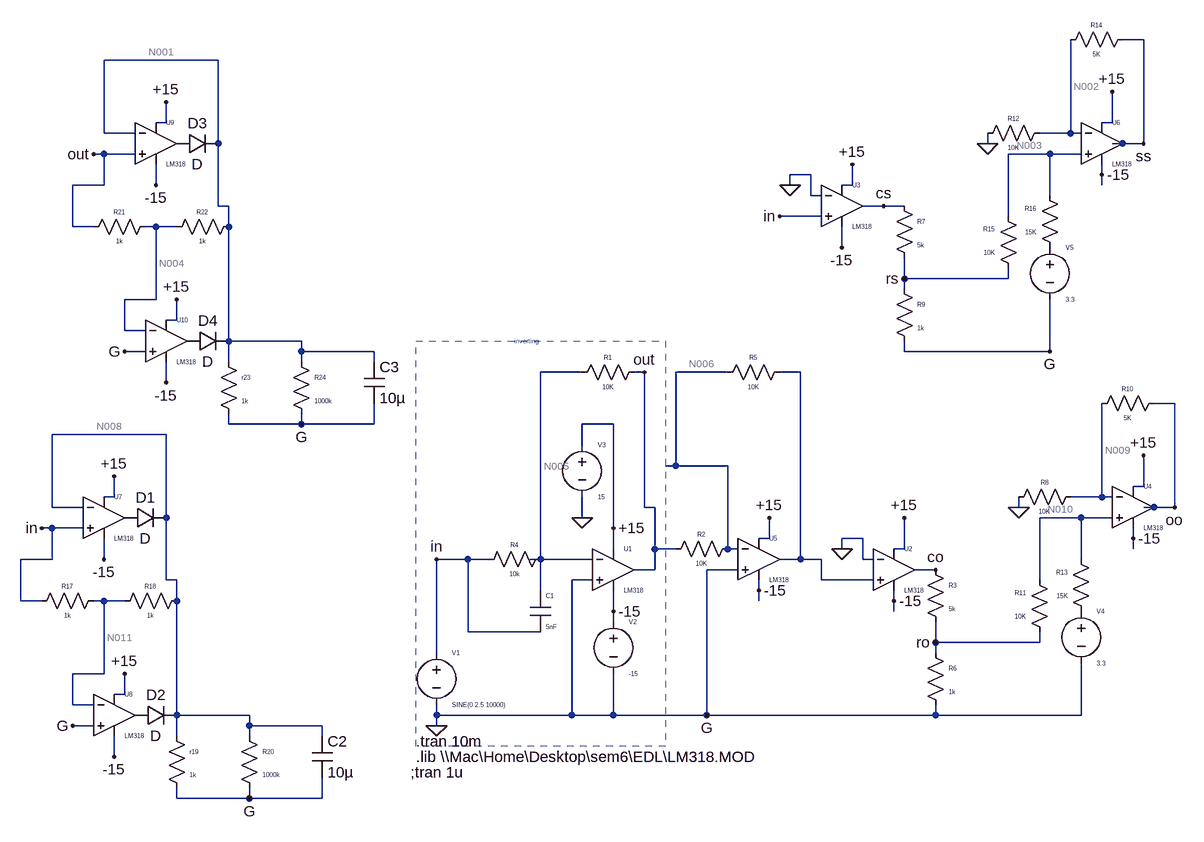
[diagram p0: schematic LM118.asc]
LM118.asc, the LTspice schematic file:
Version 4
SHEET 1 2252 1484
WIRE 1424 -832 1392 -832
WIRE 0 -800 -176 -800
WIRE -80 -704 -80 -736
WIRE -80 -704 -96 -704
WIRE 1376 -704 1376 -752
WIRE 1376 -704 1360 -704
WIRE -176 -688 -176 -800
WIRE -128 -688 -176 -688
WIRE 1312 -688 1312 -832
WIRE 1312 -688 1264 -688
WIRE 1328 -688 1312 -688
WIRE 0 -672 0 -800
WIRE 1184 -672 1184 -688
WIRE 1392 -672 1376 -672
WIRE 1424 -672 1424 -832
WIRE 1424 -672 1392 -672
WIRE -176 -656 -192 -656
WIRE -128 -656 -176 -656
WIRE 1280 -656 1216 -656
WIRE 1328 -656 1280 -656
WIRE 912 -624 880 -624
WIRE 1360 -624 1360 -640
WIRE -176 -608 -176 -656
WIRE -176 -608 -224 -608
WIRE -96 -608 -96 -640
WIRE 880 -608 880 -624
WIRE 976 -608 976 -640
WIRE 976 -608 960 -608
WIRE 1360 -608 1360 -624
WIRE 912 -592 912 -624
WIRE 928 -592 912 -592
WIRE 1280 -592 1280 -656
WIRE 0 -576 0 -672
WIRE 16 -576 0 -576
WIRE 1024 -576 992 -576
WIRE 1056 -576 1024 -576
WIRE 928 -560 864 -560
WIRE 1216 -560 1216 -656
WIRE -224 -544 -224 -608
WIRE -192 -544 -224 -544
WIRE -96 -544 -112 -544
WIRE -64 -544 -96 -544
WIRE 16 -544 16 -576
WIRE 960 -512 960 -544
WIRE 1056 -464 1056 -496
WIRE 1216 -464 1216 -480
WIRE 1216 -464 1056 -464
WIRE 1056 -448 1056 -464
WIRE -96 -432 -96 -544
WIRE -96 -432 -144 -432
WIRE -64 -400 -64 -432
WIRE -64 -400 -80 -400
WIRE -144 -384 -144 -432
WIRE -112 -384 -144 -384
WIRE 16 -368 16 -544
WIRE 128 -368 16 -368
WIRE -112 -352 -144 -352
WIRE 128 -352 128 -368
WIRE 240 -352 128 -352
WIRE 1056 -352 1056 -368
WIRE 1280 -352 1280 -432
WIRE 1280 -352 1056 -352
WIRE 16 -336 16 -368
WIRE 128 -336 128 -352
WIRE 240 -336 240 -352
WIRE 560 -320 496 -320
WIRE 656 -320 640 -320
WIRE 784 -320 704 -320
WIRE 896 -320 864 -320
WIRE -80 -304 -80 -336
WIRE 1472 -272 1440 -272
WIRE 16 -240 16 -256
WIRE 128 -240 128 -256
WIRE 128 -240 16 -240
WIRE 240 -240 240 -272
WIRE 240 -240 128 -240
WIRE 608 -240 560 -240
WIRE -80 -224 -256 -224
WIRE 560 -208 560 -240
WIRE 704 -176 704 -320
WIRE 704 -176 688 -176
WIRE 784 -176 704 -176
WIRE 1424 -144 1424 -192
WIRE 1424 -144 1408 -144
WIRE -160 -128 -160 -160
WIRE -160 -128 -176 -128
WIRE 1360 -128 1360 -272
WIRE 1360 -128 1312 -128
WIRE 1376 -128 1360 -128
WIRE -256 -112 -256 -224
WIRE -208 -112 -256 -112
WIRE 656 -112 656 -320
WIRE 672 -112 656 -112
WIRE 1232 -112 1232 -128
WIRE 1440 -112 1424 -112
WIRE 1472 -112 1472 -272
WIRE 1472 -112 1440 -112
WIRE -80 -96 -80 -224
WIRE 560 -96 560 -128
WIRE 1328 -96 1264 -96
WIRE 1376 -96 1328 -96
WIRE -256 -80 -272 -80
WIRE -208 -80 -256 -80
WIRE 608 -80 608 -240
WIRE 848 -64 848 -96
WIRE 848 -64 832 -64
WIRE 992 -64 960 -64
WIRE 1408 -64 1408 -80
WIRE 608 -48 608 -80
WIRE 672 -48 672 -112
WIRE 704 -48 672 -48
WIRE 784 -48 784 -176
WIRE 800 -48 784 -48
WIRE 960 -48 960 -64
WIRE 1056 -48 1056 -96
WIRE 1056 -48 1040 -48
WIRE 1408 -48 1408 -64
WIRE -256 -32 -256 -80
WIRE -256 -32 -304 -32
WIRE -176 -32 -176 -64
WIRE 384 -32 336 -32
WIRE 416 -32 384 -32
WIRE 496 -32 496 -320
WIRE 496 -32 480 -32
WIRE 576 -32 496 -32
WIRE 896 -32 896 -320
WIRE 896 -32 864 -32
WIRE 928 -32 896 -32
WIRE 992 -32 992 -64
WIRE 1008 -32 992 -32
WIRE 1328 -32 1328 -96
WIRE 672 -16 672 -48
WIRE 672 -16 640 -16
WIRE 800 -16 752 -16
WIRE 1104 -16 1072 -16
WIRE -80 0 -80 -96
WIRE -64 0 -80 0
WIRE 576 0 544 0
WIRE 928 0 928 -32
WIRE 1008 0 928 0
WIRE 1264 0 1264 -96
WIRE 496 16 496 -32
WIRE 832 16 832 0
WIRE -304 32 -304 -32
WIRE -272 32 -304 32
WIRE -176 32 -192 32
WIRE -144 32 -176 32
WIRE -64 32 -64 0
WIRE 832 32 832 16
WIRE 1040 32 1040 16
WIRE 608 48 608 16
WIRE 1040 48 1040 32
WIRE 608 64 608 48
WIRE 384 80 384 -32
WIRE 496 80 384 80
WIRE 1104 96 1104 64
WIRE 1264 96 1264 80
WIRE 1264 96 1104 96
WIRE 336 112 336 -32
WIRE 1104 112 1104 96
WIRE -176 144 -176 32
WIRE -176 144 -224 144
WIRE -144 176 -144 144
WIRE -144 176 -160 176
WIRE -224 192 -224 144
WIRE -192 192 -224 192
WIRE -64 208 -64 32
WIRE 48 208 -64 208
WIRE 336 208 336 192
WIRE 544 208 544 0
WIRE 544 208 336 208
WIRE 608 208 608 144
WIRE 608 208 544 208
WIRE 752 208 752 -16
WIRE 752 208 608 208
WIRE 1104 208 1104 192
WIRE 1104 208 752 208
WIRE 1328 208 1328 128
WIRE 1328 208 1104 208
WIRE -192 224 -224 224
WIRE 48 224 48 208
WIRE 160 224 48 224
WIRE 336 224 336 208
WIRE -64 240 -64 208
WIRE 48 240 48 224
WIRE 160 240 160 224
WIRE -160 272 -160 240
WIRE -64 336 -64 320
WIRE 48 336 48 320
WIRE 48 336 -64 336
WIRE 160 336 160 304
WIRE 160 336 48 336
FLAG 336 224 0
FLAG 656 -320 out
FLAG 336 -32 in
FLAG 560 -96 0
FLAG 880 -608 0
FLAG 1024 -576 cs
FLAG 864 -560 in
FLAG 960 -48 0
FLAG 1104 -16 co
FLAG 608 -80 +15
FLAG 848 -96 +15
FLAG 1056 -96 +15
FLAG 976 -640 +15
FLAG 608 48 -15
FLAG 832 16 -15
FLAG 1040 32 -15
FLAG 960 -512 -15
FLAG 1104 96 ro
FLAG 1232 -112 0
FLAG 1424 -192 +15
FLAG 1408 -64 -15
FLAG 1472 -112 oo
FLAG 1056 -464 rs
FLAG 1184 -672 0
FLAG 1376 -752 +15
FLAG 1360 -624 -15
FLAG 1424 -672 ss
FLAG 752 208 G
FLAG 1280 -352 G
FLAG -272 -80 in
FLAG -160 -160 +15
FLAG -176 -32 -15
FLAG -144 144 +15
FLAG -160 272 -15
FLAG -224 224 G
FLAG 48 336 G
FLAG -192 -656 out
FLAG -80 -736 +15
FLAG -96 -608 -15
FLAG -64 -432 +15
FLAG -80 -304 -15
FLAG -144 -352 G
FLAG 128 -240 G
SYMBOL voltage 336 96 R0
WINDOW 0 24 16 Left 0
WINDOW 3 24 96 Left 0
WINDOW 123 0 0 Left 0
WINDOW 39 0 0 Left 0
SYMATTR InstName V1
SYMATTR Value SINE(0 2.5 10000)
SYMBOL res 512 -48 R90
WINDOW 0 0 56 VBottom 0
WINDOW 3 32 56 VTop 0
SYMATTR InstName R4
SYMATTR Value 10k
SYMBOL res 656 -336 R90
WINDOW 0 0 56 VBottom 0
WINDOW 3 32 56 VTop 0
SYMATTR InstName R1
SYMATTR Value 10K
SYMBOL voltage 608 48 R0
WINDOW 0 24 16 Left 0
WINDOW 3 24 96 Left 0
WINDOW 123 0 0 Left 0
WINDOW 39 0 0 Left 0
SYMATTR InstName V2
SYMATTR Value -15
SYMBOL voltage 560 -224 R0
WINDOW 0 24 16 Left 0
WINDOW 3 24 96 Left 0
WINDOW 123 0 0 Left 0
WINDOW 39 0 0 Left 0
SYMATTR InstName V3
SYMATTR Value 15
SYMBOL cap 480 16 R0
WINDOW 0 24 8 Left 0
WINDOW 3 24 56 Left 0
SYMATTR InstName C1
SYMATTR Value 5nF
SYMBOL Opamps\\opamp2 608 -80 R0
WINDOW 0 16 32 Left 0
WINDOW 3 16 96 Left 0
SYMATTR InstName U1
SYMATTR Value LM318
SYMBOL Opamps\\opamp2 1040 -80 R0
WINDOW 0 16 32 Left 0
WINDOW 3 16 96 Left 0
SYMATTR InstName U2
SYMATTR Value LM318
SYMBOL Opamps\\opamp2 960 -640 R0
WINDOW 0 16 32 Left 0
WINDOW 3 16 96 Left 0
SYMATTR InstName U3
SYMATTR Value LM318
SYMBOL Opamps\\opamp2 832 -96 R0
WINDOW 0 16 32 Left 0
WINDOW 3 16 96 Left 0
SYMATTR InstName U5
SYMATTR Value LM318
SYMBOL res 800 -64 R90
WINDOW 0 0 56 VBottom 0
WINDOW 3 32 56 VTop 0
SYMATTR InstName R2
SYMATTR Value 10K
SYMBOL res 880 -336 R90
WINDOW 0 0 56 VBottom 0
WINDOW 3 32 56 VTop 0
SYMATTR InstName R5
SYMATTR Value 10K
SYMBOL res 1088 -32 R0
WINDOW 0 36 40 Left 0
WINDOW 3 36 76 Left 0
SYMATTR InstName R3
SYMATTR Value 5k
SYMBOL res 1088 96 R0
WINDOW 0 36 40 Left 0
WINDOW 3 36 76 Left 0
SYMATTR InstName R6
SYMATTR Value 1k
SYMBOL res 1328 -144 R90
WINDOW 0 0 56 VBottom 0
WINDOW 3 32 56 VTop 0
SYMATTR InstName R8
SYMATTR Value 10K
SYMBOL res 1456 -288 R90
WINDOW 0 0 56 VBottom 0
WINDOW 3 32 56 VTop 0
SYMATTR InstName R10
SYMATTR Value 5K
SYMBOL Opamps\\opamp2 1408 -176 R0
WINDOW 0 16 32 Left 0
WINDOW 3 16 96 Left 0
SYMATTR InstName U4
SYMATTR Value LM318
SYMBOL res 1280 96 R180
WINDOW 0 36 76 Left 0
WINDOW 3 36 40 Left 0
SYMATTR InstName R11
SYMATTR Value 10K
SYMBOL voltage 1328 32 R0
WINDOW 0 24 16 Left 0
WINDOW 3 24 96 Left 0
WINDOW 123 0 0 Left 0
WINDOW 39 0 0 Left 0
SYMATTR InstName V4
SYMATTR Value 3.3
SYMBOL res 1344 64 R180
WINDOW 0 36 76 Left 0
WINDOW 3 36 40 Left 0
SYMATTR InstName R13
SYMATTR Value 15K
SYMBOL res 1040 -592 R0
WINDOW 0 36 40 Left 0
WINDOW 3 36 76 Left 0
SYMATTR InstName R7
SYMATTR Value 5k
SYMBOL res 1040 -464 R0
WINDOW 0 36 40 Left 0
WINDOW 3 36 76 Left 0
SYMATTR InstName R9
SYMATTR Value 1k
SYMBOL res 1280 -704 R90
WINDOW 0 0 56 VBottom 0
WINDOW 3 32 56 VTop 0
SYMATTR InstName R12
SYMATTR Value 10K
SYMBOL res 1408 -848 R90
WINDOW 0 0 56 VBottom 0
WINDOW 3 32 56 VTop 0
SYMATTR InstName R14
SYMATTR Value 5K
SYMBOL Opamps\\opamp2 1360 -736 R0
WINDOW 0 16 32 Left 0
WINDOW 3 16 96 Left 0
SYMATTR InstName U6
SYMATTR Value LM318
SYMBOL res 1232 -464 R180
WINDOW 0 36 76 Left 0
WINDOW 3 36 40 Left 0
SYMATTR InstName R15
SYMATTR Value 10K
SYMBOL voltage 1280 -528 R0
WINDOW 0 24 16 Left 0
WINDOW 3 24 96 Left 0
WINDOW 123 0 0 Left 0
WINDOW 39 0 0 Left 0
SYMATTR InstName V5
SYMATTR Value 3.3
SYMBOL res 1296 -496 R180
WINDOW 0 36 76 Left 0
WINDOW 3 36 40 Left 0
SYMATTR InstName R16
SYMATTR Value 15K
SYMBOL Opamps\\opamp2 -176 -160 R0
WINDOW 0 16 32 Left 0
WINDOW 3 16 96 Left 0
SYMATTR InstName U7
SYMATTR Value LM318
SYMBOL diode -144 -80 R270
WINDOW 0 32 32 VTop 2
WINDOW 3 0 32 VBottom 2
SYMATTR InstName D1
SYMBOL res -176 16 R90
WINDOW 0 0 56 VBottom 0
WINDOW 3 32 56 VTop 0
SYMATTR InstName R17
SYMATTR Value 1k
SYMBOL res -48 16 R90
WINDOW 0 0 56 VBottom 0
WINDOW 3 32 56 VTop 0
SYMATTR InstName R18
SYMATTR Value 1k
SYMBOL Opamps\\opamp2 -160 144 R0
WINDOW 0 16 32 Left 0
WINDOW 3 16 96 Left 0
SYMATTR InstName U8
SYMATTR Value LM318
SYMBOL diode -128 224 R270
WINDOW 0 32 32 VTop 2
WINDOW 3 0 32 VBottom 2
SYMATTR InstName D2
SYMBOL res -80 224 R0
WINDOW 0 36 40 Left 0
WINDOW 3 36 76 Left 0
SYMATTR InstName r19
SYMATTR Value 1k
SYMBOL res 32 224 R0
WINDOW 0 36 40 Left 0
WINDOW 3 36 76 Left 0
SYMATTR InstName R20
SYMATTR Value 1000k
SYMBOL cap 144 240 R0
SYMATTR InstName C2
SYMATTR Value 10µ
SYMBOL Opamps\\opamp2 -96 -736 R0
WINDOW 0 16 32 Left 0
WINDOW 3 16 96 Left 0
SYMATTR InstName U9
SYMATTR Value LM318
SYMBOL diode -64 -656 R270
WINDOW 0 32 32 VTop 2
WINDOW 3 0 32 VBottom 2
SYMATTR InstName D3
SYMBOL res -96 -560 R90
WINDOW 0 0 56 VBottom 0
WINDOW 3 32 56 VTop 0
SYMATTR InstName R21
SYMATTR Value 1k
SYMBOL res 32 -560 R90
WINDOW 0 0 56 VBottom 0
WINDOW 3 32 56 VTop 0
SYMATTR InstName R22
SYMATTR Value 1k
SYMBOL Opamps\\opamp2 -80 -432 R0
WINDOW 0 16 32 Left 0
WINDOW 3 16 96 Left 0
SYMATTR InstName U10
SYMATTR Value LM318
SYMBOL diode -48 -352 R270
WINDOW 0 32 32 VTop 2
WINDOW 3 0 32 VBottom 2
SYMATTR InstName D4
SYMBOL res 0 -352 R0
WINDOW 0 36 40 Left 0
WINDOW 3 36 76 Left 0
SYMATTR InstName r23
SYMATTR Value 1k
SYMBOL res 112 -352 R0
WINDOW 0 36 40 Left 0
WINDOW 3 36 76 Left 0
SYMATTR InstName R24
SYMATTR Value 1000k
SYMBOL cap 224 -336 R0
SYMATTR InstName C3
SYMATTR Value 10µ
TEXT 304 248 Left 2 !.tran 10m
TEXT 304 272 Left 2 !.lib \\\\Mac\\Home\\Desktop\\sem6\\EDL\\LM318.MOD
TEXT 296 296 Left 2 !;tran 1u
TEXT 456 -368 Left 0 ;inverting
RECTANGLE Normal 688 256 304 -368 2

The netlist it stands for:
* LM118.asc
V1 in 0 SINE(0 2.5 10000)
R4 N005 in 10k
R1 out N005 10K
V2 -15 0 -15
V3 +15 0 15
C1 N005 in 5nF
XU1 0 N005 +15 -15 out LM318  ; pins In+ In- V+ V- OUT
XU2 N007 0 +15 -15 co LM318  ; pins In+ In- V+ V- OUT
XU3 in 0 +15 -15 cs LM318  ; pins In+ In- V+ V- OUT
XU5 0 N006 +15 -15 N007 LM318  ; pins In+ In- V+ V- OUT
R2 N006 out 10K
R5 N007 N006 10K
R3 co ro 5k
R6 ro 0 1k
R8 N009 0 10K
R10 oo N009 5K
XU4 N010 N009 +15 -15 oo LM318  ; pins In+ In- V+ V- OUT
R11 ro N010 10K
V4 P001 0 3.3
R13 P001 N010 15K
R7 cs rs 5k
R9 rs 0 1k
R12 N002 0 10K
R14 ss N002 5K
XU6 N003 N002 +15 -15 ss LM318  ; pins In+ In- V+ V- OUT
R15 rs N003 10K
V5 P002 0 3.3
R16 P002 N003 15K
XU7 in N008 +15 -15 P003 LM318  ; pins In+ In- V+ V- OUT
D1 P003 N008 D
R17 N011 in 1k
R18 N008 N011 1k
XU8 0 N011 +15 -15 P004 LM318  ; pins In+ In- V+ V- OUT
D2 P004 N008 D
r19 N008 0 1k
R20 N008 0 1000k
C2 N008 0 10µ
XU9 out N001 +15 -15 P005 LM318  ; pins In+ In- V+ V- OUT
D3 P005 N001 D
R21 N004 out 1k
R22 N001 N004 1k
XU10 0 N004 +15 -15 P006 LM318  ; pins In+ In- V+ V- OUT
D4 P006 N001 D
r23 N001 0 1k
R24 N001 0 1000k
C3 N001 0 10µ
.model D D
.lib standard.dio
.tran 10m
.lib \\Mac\Home\Desktop\sem6\EDL\LM318.MOD
;tran 1u
* inverting
.backanno
.end

* Results of the author's LTspice run, read from the files saved beside the schematic
* Operating Point, zero values left out:
*   V(n005) = 5.673 µV
*   V(out) = 1.503 mV
*   V(-15) = -15 V
*   V(+15) = 15 V
*   V(co) = 1.177 V
*   V(cs) = 1.174 V
*   V(n006) = 5.68 µV
*   V(ro) = 296.3 mV
*   V(n009) = 1.497 V
*   V(oo) = 2.246 V
*   V(n010) = 1.497 V
*   V(p001) = 3.3 V
*   V(rs) = 295.8 mV
*   V(n002) = 1.497 V
*   V(ss) = 2.246 V
*   V(n003) = 1.497 V
*   V(p002) = 3.3 V
*   V(p003) = -12.8 V
*   V(n008) = 156.2 µV
*   V(n011) = 3.505 µV
*   V(p004) = 456.4 mV
*   V(p005) = 492.2 mV
*   V(n001) = 1.506 mV
*   V(n004) = 1.43 mV
*   V(p006) = -12.87 V
*   I(D4) = -12.88 pA
*   I(D3) = 1.734 µA
*   I(D2) = 458.2 nA
*   I(D1) = -12.81 pA
*   I(R24) = 1.506 nA
*   I(R23) = 1.506 µA
*   I(R22) = 76.39 nA
*   I(R21) = -73.07 nA
*   I(R20) = 156.2 pA
*   I(R19) = 156.2 nA
*   I(R18) = 152.7 nA
*   I(R17) = 3.505 nA
*   I(R16) = 120.2 µA
*   I(R15) = -120.1 µA
*   I(R14) = 149.8 µA
*   I(R12) = 149.7 µA
*   I(R9) = 295.8 µA
*   I(R7) = 175.7 µA
*   I(R13) = 120.2 µA
*   I(R11) = -120.1 µA
*   I(R10) = 149.8 µA
*   I(R8) = 149.7 µA
*   I(R6) = 296.3 µA
*   I(R3) = 176.2 µA
*   I(R5) = -566.6 pA
*   I(R2) = -149.7 nA
*   I(R1) = 149.7 nA
*   I(R4) = 567.3 pA
*   I(V5) = -120.2 µA
*   I(V4) = -120.2 µA
*   I(V3) = -49.93 mA
*   I(V2) = 50 mA
*   I(V1) = -294.2 nA